# EAGLE design DDS Function Generator (EAGLE 8.2.2)
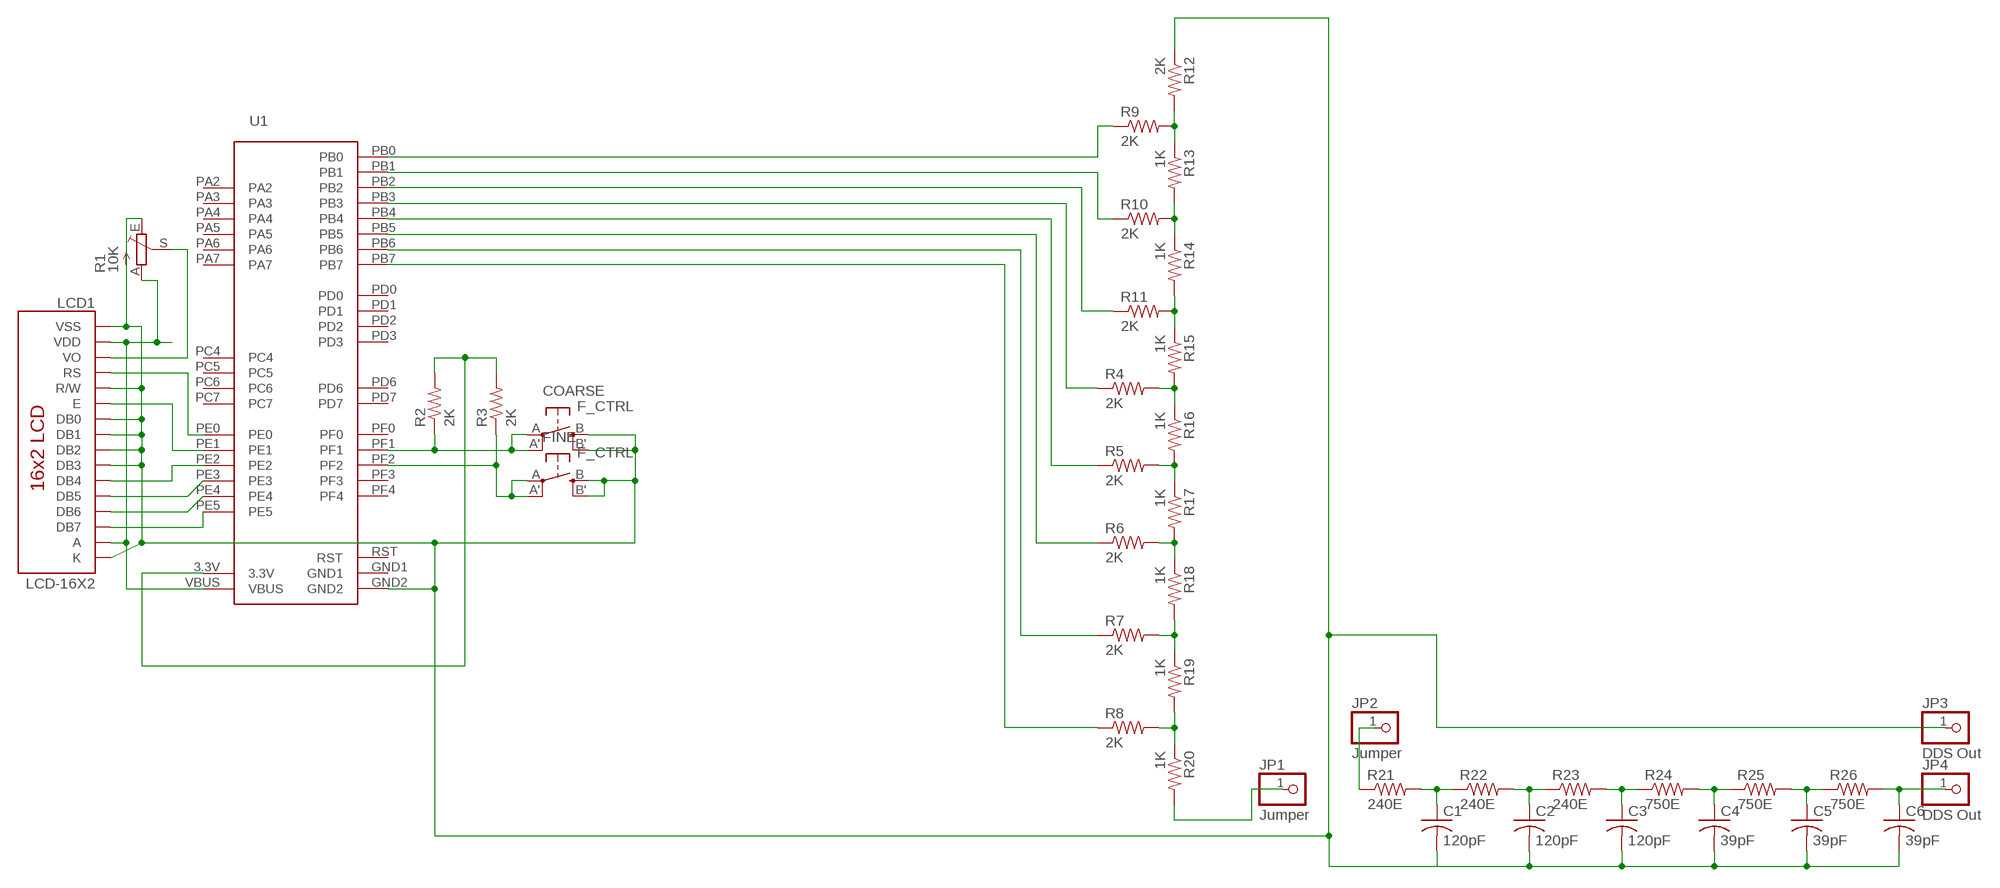
[diagram p0: schematic, sheet 1]

## Parts
C1  120pF  C-USC0805  [C0805]
C2  120pF  C-USC0805  [C0805]
C3  120pF  C-USC0805  [C0805]
C4  39pF  C-USC0603  [C0603]
C5  39pF  C-USC0603  [C0603]
C6  39pF  C-USC0603  [C0603]
COARSE  F_CTRL  SPST_TACT-EVQQ2  [EVQ-Q2]
FINE  F_CTRL  SPST_TACT-EVQQ2  [EVQ-Q2]
JP1  Jumper  PINHD-1X1  [1X01]
JP2  Jumper  PINHD-1X1  [1X01]
JP3  DDS Out  PINHD-1X1  [1X01]
JP4  DDS Out  PINHD-1X1  [1X01]
LCD1  LCD-16X2  LCD-16X2NOHOLES  [LCD-16X2_NOHOLESNOSILK]
R1  10K  TRIM_EU-B25P  [B25P]
R2  2K  R-US_R1206  [R1206]
R3  2K  R-US_R1206  [R1206]
R4  2K  R-US_R1206  [R1206]
R5  2K  R-US_R1206  [R1206]
R6  2K  R-US_R1206  [R1206]
R7  2K  R-US_R1206  [R1206]
R8  2K  R-US_R1206  [R1206]
R9  2K  R-US_R1206  [R1206]
R10  2K  R-US_R1206  [R1206]
R11  2K  R-US_R1206  [R1206]
R12  2K  R-US_R1206  [R1206]
R13  1K  R-US_R1206  [R1206]
R14  1K  R-US_R1206  [R1206]
R15  1K  R-US_R1206  [R1206]
R16  1K  R-US_R1206  [R1206]
R17  1K  R-US_R1206  [R1206]
R18  1K  R-US_R1206  [R1206]
R19  1K  R-US_R1206  [R1206]
R20  1K  R-US_R1206  [R1206]
R21  240E  R-US_R1206  [R1206]
R22  240E  R-US_R1206  [R1206]
R23  240E  R-US_R1206  [R1206]
R24  750E  R-US_R1206  [R1206]
R25  750E  R-US_R1206  [R1206]
R26  750E  R-US_R1206  [R1206]
U1  U1  STELLARIS-LAUNCHPADSTELLARIS-LAUNCHPAD  [LAUNCHPAD-XL]

## Nets
3V3: R2.2 R3.2 U1.3.3V
GND: C1.2 C2.2 C3.2 C4.2 C5.2 C6.2 COARSE.B'(S1) COARSE.B(S) FINE.B'(S1) FINE.B(S) JP3.1 LCD1.1(VSS) LCD1.5(R/W) LCD1.7(DB0) LCD1.8(DB1) LCD1.9(DB2) LCD1.10(DB3) LCD1.16(K) R1.E R12.1 U1.GND2
N$1: R7.1 U1.PB6
N$2: R9.2 R12.2 R13.1
N$3: R10.2 R13.2 R14.1
N$4: R11.2 R14.2 R15.1
N$5: R9.1 U1.PB0
N$6: R4.2 R15.2 R16.1
N$7: R10.1 U1.PB1
N$8: R11.1 U1.PB2
N$9: R5.2 R16.2 R17.1
N$10: R6.2 R17.2 R18.1
N$11: R7.2 R18.2 R19.1
N$12: R8.2 R19.2 R20.1
N$13: R4.1 U1.PB3
N$14: R5.1 U1.PB4
N$15: R6.1 U1.PB5
N$16: R8.1 U1.PB7
N$17: COARSE.A'(P1) COARSE.A(P) R2.1 U1.PF1
N$18: JP1.1 R20.2
N$19: C1.1 R21.2 R22.1
N$20: C2.1 R22.2 R23.1
N$21: C3.1 R23.2 R24.1
N$22: C4.1 R24.2 R25.1
N$23: C5.1 R25.2 R26.1
N$24: C6.1 JP4.1 R26.2
N$25: FINE.A'(P1) FINE.A(P) R3.1 U1.PF2
N$26: LCD1.2(VDD) LCD1.15(A) R1.A U1.VBUS
N$27: LCD1.4(RS) U1.PE0
N$28: LCD1.6(E) U1.PE1
N$30: LCD1.12(DB5) U1.PE3
N$31: LCD1.13(DB6) U1.PE4
N$32: LCD1.14(DB7) U1.PE5
N$34: LCD1.3(VO) R1.S
N$36: JP2.1 R21.1
N$42: LCD1.11(DB4) U1.PE2
Unconnected: U1.GND1 U1.PA2 U1.PA3 U1.PA4 U1.PA5 U1.PA6 U1.PA7 U1.PC4 U1.PC5 U1.PC6 U1.PC7 U1.PD0 U1.PD1 U1.PD2 U1.PD3 U1.PD6 U1.PD7 U1.PF0 U1.PF3 U1.PF4

## Power pins joined to a net without a drawn wire
RST: U1.RST

## Library data of the parts
C1-C6 = adafruit:C-US: CAPACITOR, American symbol
COARSE FINE = adafruit:SPST_TACT: SMT 6mm switch, EVQQ2 series http://www.ladyada.net/library/eagle
JP1-JP4 = adafruit:PINHD-1X1: Pin header 1x1 for 0.1" spacing With round pins
LCD1 = SparkFun-Displays:LCD-16X2: Standard text-only 16x2 parallel input LCD Basic 16 character by 2 line display. Typically utilizes the extremely common HD44780 parallel interface chipset SparkFun Products: Basic 16x2 Green <https://www.sparkfun.com/products/255> Basic 8x2 Green <https://www.sparkfun.com/products/11122>; SF_ID: LCD-00255
R1 = pot:TRIM_EU-: POTENTIOMETER
R2-R26 = adafruit:R-US_: RESISTOR, American symbol
U1 = fabhack:STELLARIS-LAUNCHPAD: Stellaris Launchpad LM4F120 using all header pins to connect to XL booster packs.

## Board
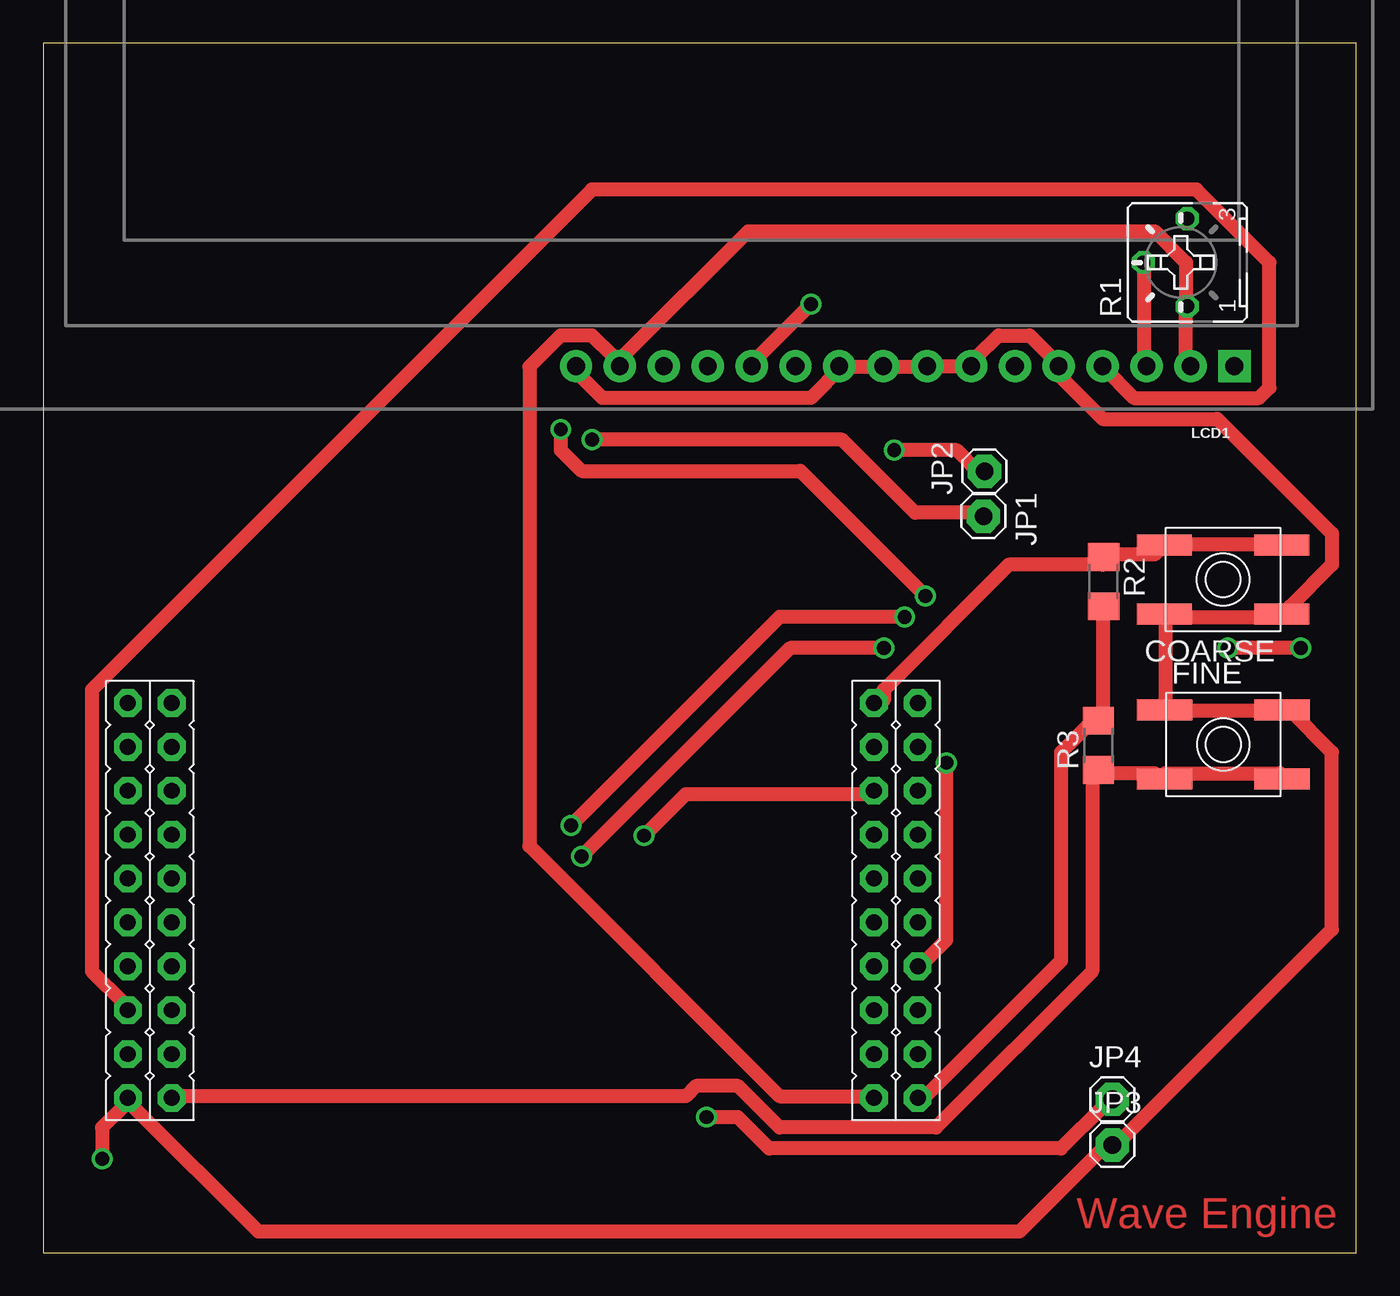
[diagram p1: board, top side]
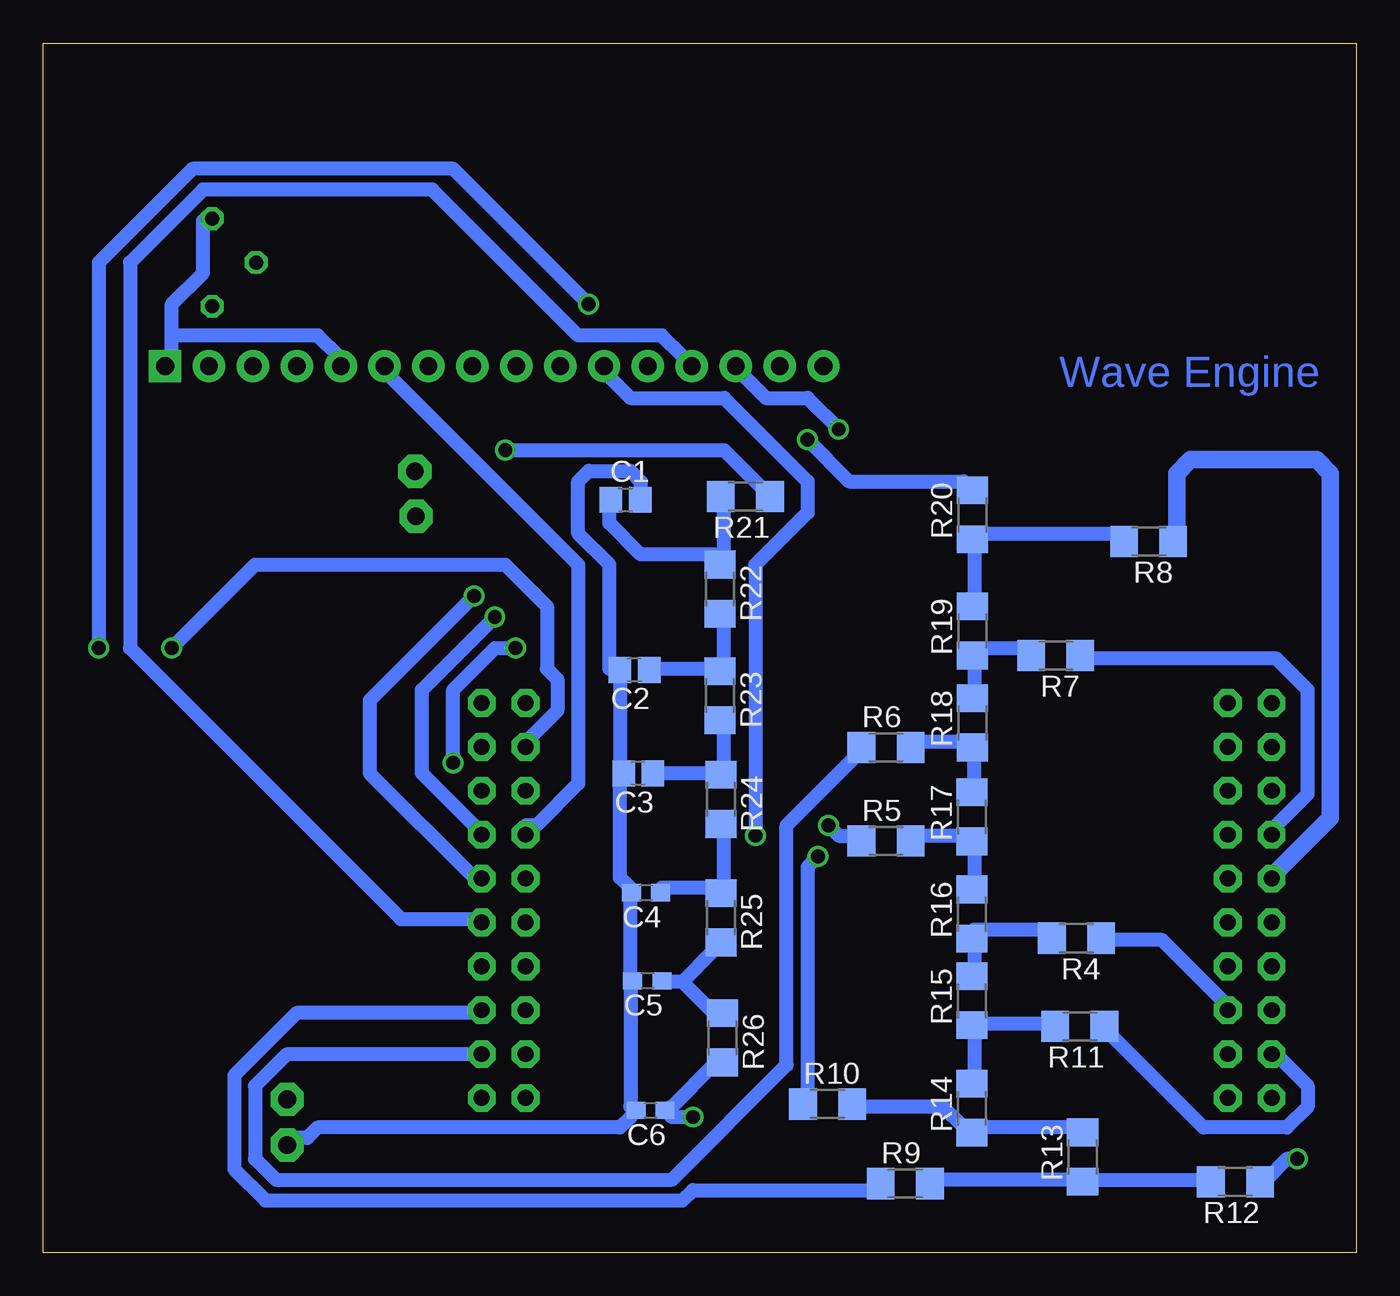
[diagram p2: board, bottom side, seen from below]

Size 76 x 70 mm. Coordinates in mm from the lower left corner, seen from the top.
Outline: 0,0 76,0 76,70 0,70 0,0
Copper layers (1*16): Top 0.035mm / dielectric 1.5mm / Bottom 0.035mm
Design rules "default *": minimum track width 0.8mm, minimum drill 0.8mm, track to track 16mil, track to pad 16mil, pad to pad 16mil, via to via 16mil, smd to smd 16mil, copper to edge 16mil, drill to drill 16mil, minimum pad ring 10mil, minimum via ring 8mil, stop-mask expansion 4mil, vias tented up to drill 0mil, thermal gap 10mil

### Footprints (pad centres in the part's own frame; a part is rotated, then mirrored left to right if it is on the bottom)
C0805 = smd 1.3 x 1.5: 1 -0.85,0; 2 0.85,0
C0603 = smd 1.1 x 1: 1 -0.85,0; 2 0.85,0
EVQ-Q2 = smd 3.2 x 1.2: A -3.4,-2; A' 3.4,-2; B -3.4,2; B' 3.4,2
1X01 = drill 1.016 pad 1.93 octagon: 1 0,0
LCD-16X2_NOHOLESNOSILK = drill 1.016 pad 1.88 square: 1 -32,15.5 | drill 1.016 pad 1.88: 2 -29.46,15.5; 3 -26.92,15.5; 4 -24.38,15.5; 5 -21.84,15.5; 6 -19.3,15.5; 7 -16.76,15.5; 8 -14.22,15.5; 9 -11.68,15.5; 10 -9.14,15.5; 11 -6.6,15.5; 12 -4.06,15.5; 13 -1.52,15.5; 14 1.02,15.5; 15 3.56,15.5; 16 6.1,15.5
B25P = drill 0.813 octagon: A -2.54,0; E 2.54,0; S 0,2.54
R1206 = smd 1.6 x 1.803: 1 -1.422,0; 2 1.422,0
LAUNCHPAD-XL = drill 0.914 pad 1.6 octagon: 3.3V 30.48,2.54; GND1 33.02,5.08; GND2 30.48,48.26; PA2 53.34,48.26; PA3 50.8,48.26; PA4 48.26,48.26; PA5 48.26,2.54; PA6 50.8,2.54; PA7 53.34,2.54; PB0 35.56,2.54; PB1 38.1,2.54; PB2 33.02,48.26; PB3 35.56,45.72; PB4 45.72,2.54; PB5 33.02,2.54; PB6 45.72,48.26; PB7 43.18,48.26; PC4 38.1,45.72; PC5 40.64,45.72; PC6 43.18,45.72; PC7 45.72,45.72; PD0 35.56,5.08; PD1 38.1,5.08; PD2 40.64,5.08; PD3 43.18,5.08; PD6 48.26,45.72; PD7 50.8,45.72; PE0 35.56,48.26; PE1 45.72,5.08; PE2 48.26,5.08; PE3 50.8,5.08; PE4 40.64,2.54; PE5 43.18,2.54; PF0 38.1,48.26; PF1 53.34,5.08; PF2 30.48,45.72; PF3 33.02,45.72; PF4 53.34,45.72; RST 40.64,48.26; VBUS 30.48,5.08

### Placement (x,y rotation side)
C1  42.3,43.57 0 bottom
C2  41.78,33.73 180 bottom
C3  41.56,27.73 180 bottom
C4  41.11,20.83 180 bottom
C5  41.03,15.73 180 bottom
C6  40.85,8.23 180 bottom
COARSE  68.29,38.96 180 top
FINE  68.31,29.41 0 top
JP1  54.42,42.62 270 top
JP2  54.48,45.22 90 top
JP3  61.88,6.23 0 top
JP4  61.88,8.87 0 top
LCD1  36.94,66.81 180 top
R1  66.22,57.31 90 top
R2  61.37,38.84 270 top
R3  61.08,29.36 90 top
R4  16.2,18.2 180 bottom
R5  27.22,23.82 0 bottom
R6  27.22,29.24 0 bottom
R7  17.4,34.56 180 bottom
R8  12.02,41.16 180 bottom
R9  26.1,4 0 bottom
R10  30.6,8.6 0 bottom
R11  16,13.1 180 bottom
R12  7,4.1 180 bottom
R13  15.84,5.54 90 bottom
R14  22.24,8.36 90 bottom
R15  22.24,14.58 90 bottom
R16  22.24,19.6 90 bottom
R17  22.24,25.22 90 bottom
R18  22.22,30.66 90 bottom
R19  22.22,35.98 90 bottom
R20  22.22,42.7 90 bottom
R21  35.36,43.76 180 bottom
R22  36.82,38.4 270 bottom
R23  36.82,32.23 270 bottom
R24  36.78,26.23 270 bottom
R25  36.78,19.38 270 bottom
R26  36.68,12.43 270 bottom
U1  53.16,-21.53 90 top

### Tracks (layer width: path | path; a pad name or v marks a point on that pad's centre or on a via)
3V3
  Top 0.8: R2.2 61.32,37.4 61.32,31.37 R3.2 60.72,30.76 58.91,28.95 58.91,16.89 51.07,9.05 U1.3.3V
GND  (via drill 0.8)
  Top 0.8: 64.94,36.8 64.94,31.97 FINE.B 64.94,31.37 71.57,31.37 FINE.B' 72.18,31.37 74.59,28.95 74.59,18.7 61.92,6.03 JP3.1 61.32,6.03 56.49,1.21 12.46,1.21 5.22,8.45 U1.GND2 4.62,8.45 3.41,7.24 v3.41,5.43 | 64.94,36.8 71.57,36.8 COARSE.B 72.18,37.4 74.59,39.81 74.59,41.62 67.95,48.26 61.32,48.26 58.3,51.27 LCD1.5 58.3,51.88 57.1,53.08 55.29,53.08 54.08,51.88 LCD1.7 53.48,51.27 51.67,51.27 LCD1.8 51.07,51.27 48.65,51.27 LCD1.9 48.05,51.27 46.24,51.27 | 64.94,36.8 COARSE.B' | 46.24,51.27 44.43,49.46 32.37,49.46 31.16,50.67 31.16,51.27 LCD1.16 | 46.24,51.27 LCD1.10
  Bottom 0.8: 68.56,53.08 68.56,51.88 LCD1.1 | 68.56,53.08 68.56,54.89 66.75,56.7 66.75,59.72 R1.E | 68.56,53.08 60.11,53.08 58.91,51.88 LCD1.5 | C1.2 41.41,44.03 41.41,44.64 42.02,45.24 44.43,45.24 45.03,44.64 45.03,41.62 43.22,39.81 43.22,33.78 C2.2 42.62,33.18 42.62,27.75 C3.2 42.62,27.14 42.62,21.71 42.02,21.11 C4.2 42.02,20.51 42.02,15.68 | v3.41,5.43 4.02,5.43 5.22,4.22 R12.1 | 42.02,15.68 42.02,8.45 C6.2 42.02,7.84 42.62,7.24 60.11,7.24 60.72,6.63 61.32,6.63 JP3.1 | 42.02,15.68 C5.2
N$1
  Bottom 0.8: R7.1 15.48,34.38 4.62,34.38 2.81,32.57 2.81,26.54 4.62,24.73 U1.PB6
N$2
  Bottom 0.8: R12.2 8.84,4.22 15.48,4.22 R13.1 16.08,4.22 24.52,4.22 R9.2
N$3
  Bottom 0.8: R13.2 16.08,7.24 22.11,7.24 R14.1 22.71,7.24 23.92,8.45 28.75,8.45 R10.2
N$4
  Bottom 0.8: R14.2 22.11,10.25 22.11,12.67 R15.1 22.11,13.27 17.89,13.27 R11.2
N$5
  Bottom 0.8: R9.1 27.54,3.62 38.4,3.62 39,3.02 63.13,3.02 64.94,4.83 64.94,10.25 61.32,13.87 51.07,13.87 U1.PB0
N$6
  Bottom 0.8: R15.2 22.11,16.29 22.11,18.1 R16.1 22.11,18.7 17.89,18.7 R4.2
N$7  (via drill 0.8)
  Top 0.8: v31.16,22.92 43.22,34.99 v48.65,34.99 | v52.27,28.35 52.27,18.1 51.07,16.89 U1.PB1
  Bottom 0.8: v31.16,22.92 31.76,22.32 31.76,9.05 R10.1 | v48.65,34.99 49.86,34.99 52.27,32.57 v52.27,28.35
N$8
  Bottom 0.8: R11.1 14.27,12.67 8.84,7.24 4.02,7.24 2.81,8.45 2.81,9.65 4.62,11.46 U1.PB2
N$9
  Bottom 0.8: R16.2 22.11,21.11 22.11,23.52 R17.1 22.71,24.13 25.73,24.13 R5.2
N$10
  Bottom 0.8: R17.2 22.11,27.14 22.11,28.95 R18.1 22.71,29.56 25.73,29.56 R6.2
N$11
  Bottom 0.8: R18.2 22.11,32.57 22.11,34.38 R19.1 22.11,34.99 19.1,34.99 R7.2
N$12
  Bottom 0.8: R19.2 22.11,38 22.11,41.02 R20.1 22.11,41.62 13.67,41.62 R8.2
N$13
  Bottom 0.8: R4.1 14.27,18.1 11.25,18.1 7.63,14.48 U1.PB3
N$14  (via drill 0.8)
  Top 0.8: v30.56,24.73 42.62,36.8 v49.86,36.8
  Bottom 0.8: v30.56,24.73 29.95,24.13 28.75,24.13 R5.1 | v49.86,36.8 54.08,32.57 54.08,27.75 51.07,24.73 U1.PB4
N$15
  Bottom 0.8: R6.1 28.75,28.95 32.97,24.73 32.97,10.86 39.6,4.22 62.53,4.22 63.73,5.43 63.73,9.65 61.92,11.46 51.07,11.46 U1.PB5
N$16
  Bottom 1.016: U1.PB7 4.9,21.77 1.5,25.17 1.5,33.12 1.5,45.1 2.3,45.9 9.6,45.9 10.4,45.1 10.4,41.36 R8.1
N$17
  Top 0.8: COARSE.A 71.57,41.02 64.94,41.02 COARSE.A' 64.34,40.41 61.92,40.41 R2.1 61.32,39.81 55.89,39.81 48.65,32.57 48.65,31.97 U1.PF1
N$18  (via drill 0.8)
  Top 0.8: v31.76,47.05 46.24,47.05 50.46,42.83 54.08,42.83 JP1.1
  Bottom 0.8: v31.76,47.05 29.35,44.64 22.71,44.64 R20.2
N$19
  Bottom 0.8: C1.1 43.22,43.43 43.22,42.22 41.41,40.41 37.19,40.41 R22.1 36.59,40.41 36.59,43.43 R21.2
N$20
  Bottom 0.8: C2.1 40.81,33.78 37.19,33.78 R23.1 36.59,33.78 36.59,36.8 R22.2
N$21
  Bottom 0.8: C3.1 40.21,27.75 37.19,27.75 R24.1 36.59,27.75 36.59,30.76 R23.2
N$22
  Bottom 0.8: C4.1 40.21,21.11 37.19,21.11 R25.1 36.59,21.11 36.59,24.73 R24.2
N$23
  Bottom 0.8: 39,15.68 40.21,15.68 C5.1 | 39,15.68 37.19,17.49 R25.2 | 39,15.68 37.19,13.87 R26.1
N$24  (via drill 0.8)
  Top 0.8: v38.4,7.84 40.21,7.84 42.02,6.03 58.91,6.03 61.32,8.45 JP4.1
  Bottom 0.8: R26.2 37.19,10.86 39.6,8.45 C6.1 39.6,7.84 v38.4,7.84
N$25
  Top 0.8: FINE.A' 71.57,27.75 64.94,27.75 FINE.A 64.34,27.75 61.32,27.75 R3.1 60.72,27.75 60.72,16.29 51.67,7.24 42.62,7.24 40.21,9.65 37.8,9.65 37.19,9.05 7.63,9.05 U1.PF2
N$26
  Top 0.8: LCD1.2 66.15,51.88 66.15,54.29 R1.A 66.15,54.89 66.15,57.3 64.34,59.11 40.81,59.11 33.57,51.88 LCD1.15 32.97,51.88 31.76,53.08 29.95,53.08 28.14,51.27 28.14,23.52 42.62,9.05 48.05,9.05 U1.VBUS
N$27
  Top 0.8: U1.PE0 4.62,14.48 2.81,16.29 2.81,32.57 31.76,61.53 66.75,61.53 70.97,57.3 70.97,50.07 70.37,49.46 63.13,49.46 61.32,51.27 LCD1.4
N$28
  Bottom 0.8: U1.PE1 48.05,24.73 47.45,24.73 45.03,27.14 45.03,39.81 56.49,51.27 LCD1.6
N$30  (via drill 0.8)
  Top 0.8: v72.78,34.99 v68.56,34.99 | v44.43,54.89 41.41,51.88 LCD1.12
  Bottom 0.8: v68.56,34.99 63.73,39.81 49.26,39.81 46.84,37.4 46.84,33.78 46.24,33.18 46.24,31.37 48.05,29.56 U1.PE3 | v72.78,34.99 72.78,57.3 67.35,62.73 52.27,62.73 v44.43,54.89
N$31
  Bottom 0.8: U1.PE4 51.07,19.3 55.29,19.3 70.97,34.99 70.97,57.3 66.75,61.53 53.48,61.53 45.03,53.08 40.21,53.08 39,51.88 LCD1.13
N$32  (via drill 0.8)
  Top 0.8: v51.07,38 43.83,45.24 31.16,45.24 29.95,46.45 v29.95,47.65
  Bottom 0.8: v51.07,38 57.1,31.97 57.1,27.75 51.07,21.71 U1.PE5 | v29.95,47.65 31.76,49.46 34.18,49.46 35.99,51.27 LCD1.14
N$34
  Top 0.8: R1.S 63.73,57.3 63.73,51.88 LCD1.3
N$36  (via drill 0.8)
  Top 0.8: v49.26,46.45 52.88,46.45 54.08,45.24 JP2.1
  Bottom 0.8: v49.26,46.45 36.59,46.45 34.18,44.03 R21.1
N$42  (via drill 0.8)
  Top 0.8: v34.78,24.13 37.19,26.54 48.05,26.54 U1.PE2
  Bottom 0.8: v34.78,24.13 34.78,39.81 31.76,42.83 31.76,44.64 36.59,49.46 42.02,49.46 43.83,51.27 LCD1.11

### Text on the board
Top: Wave Engine
Bottom: Wave Engine